# EasyEDA Pro project BH1750模块.epro

# Schematic BH1750模块
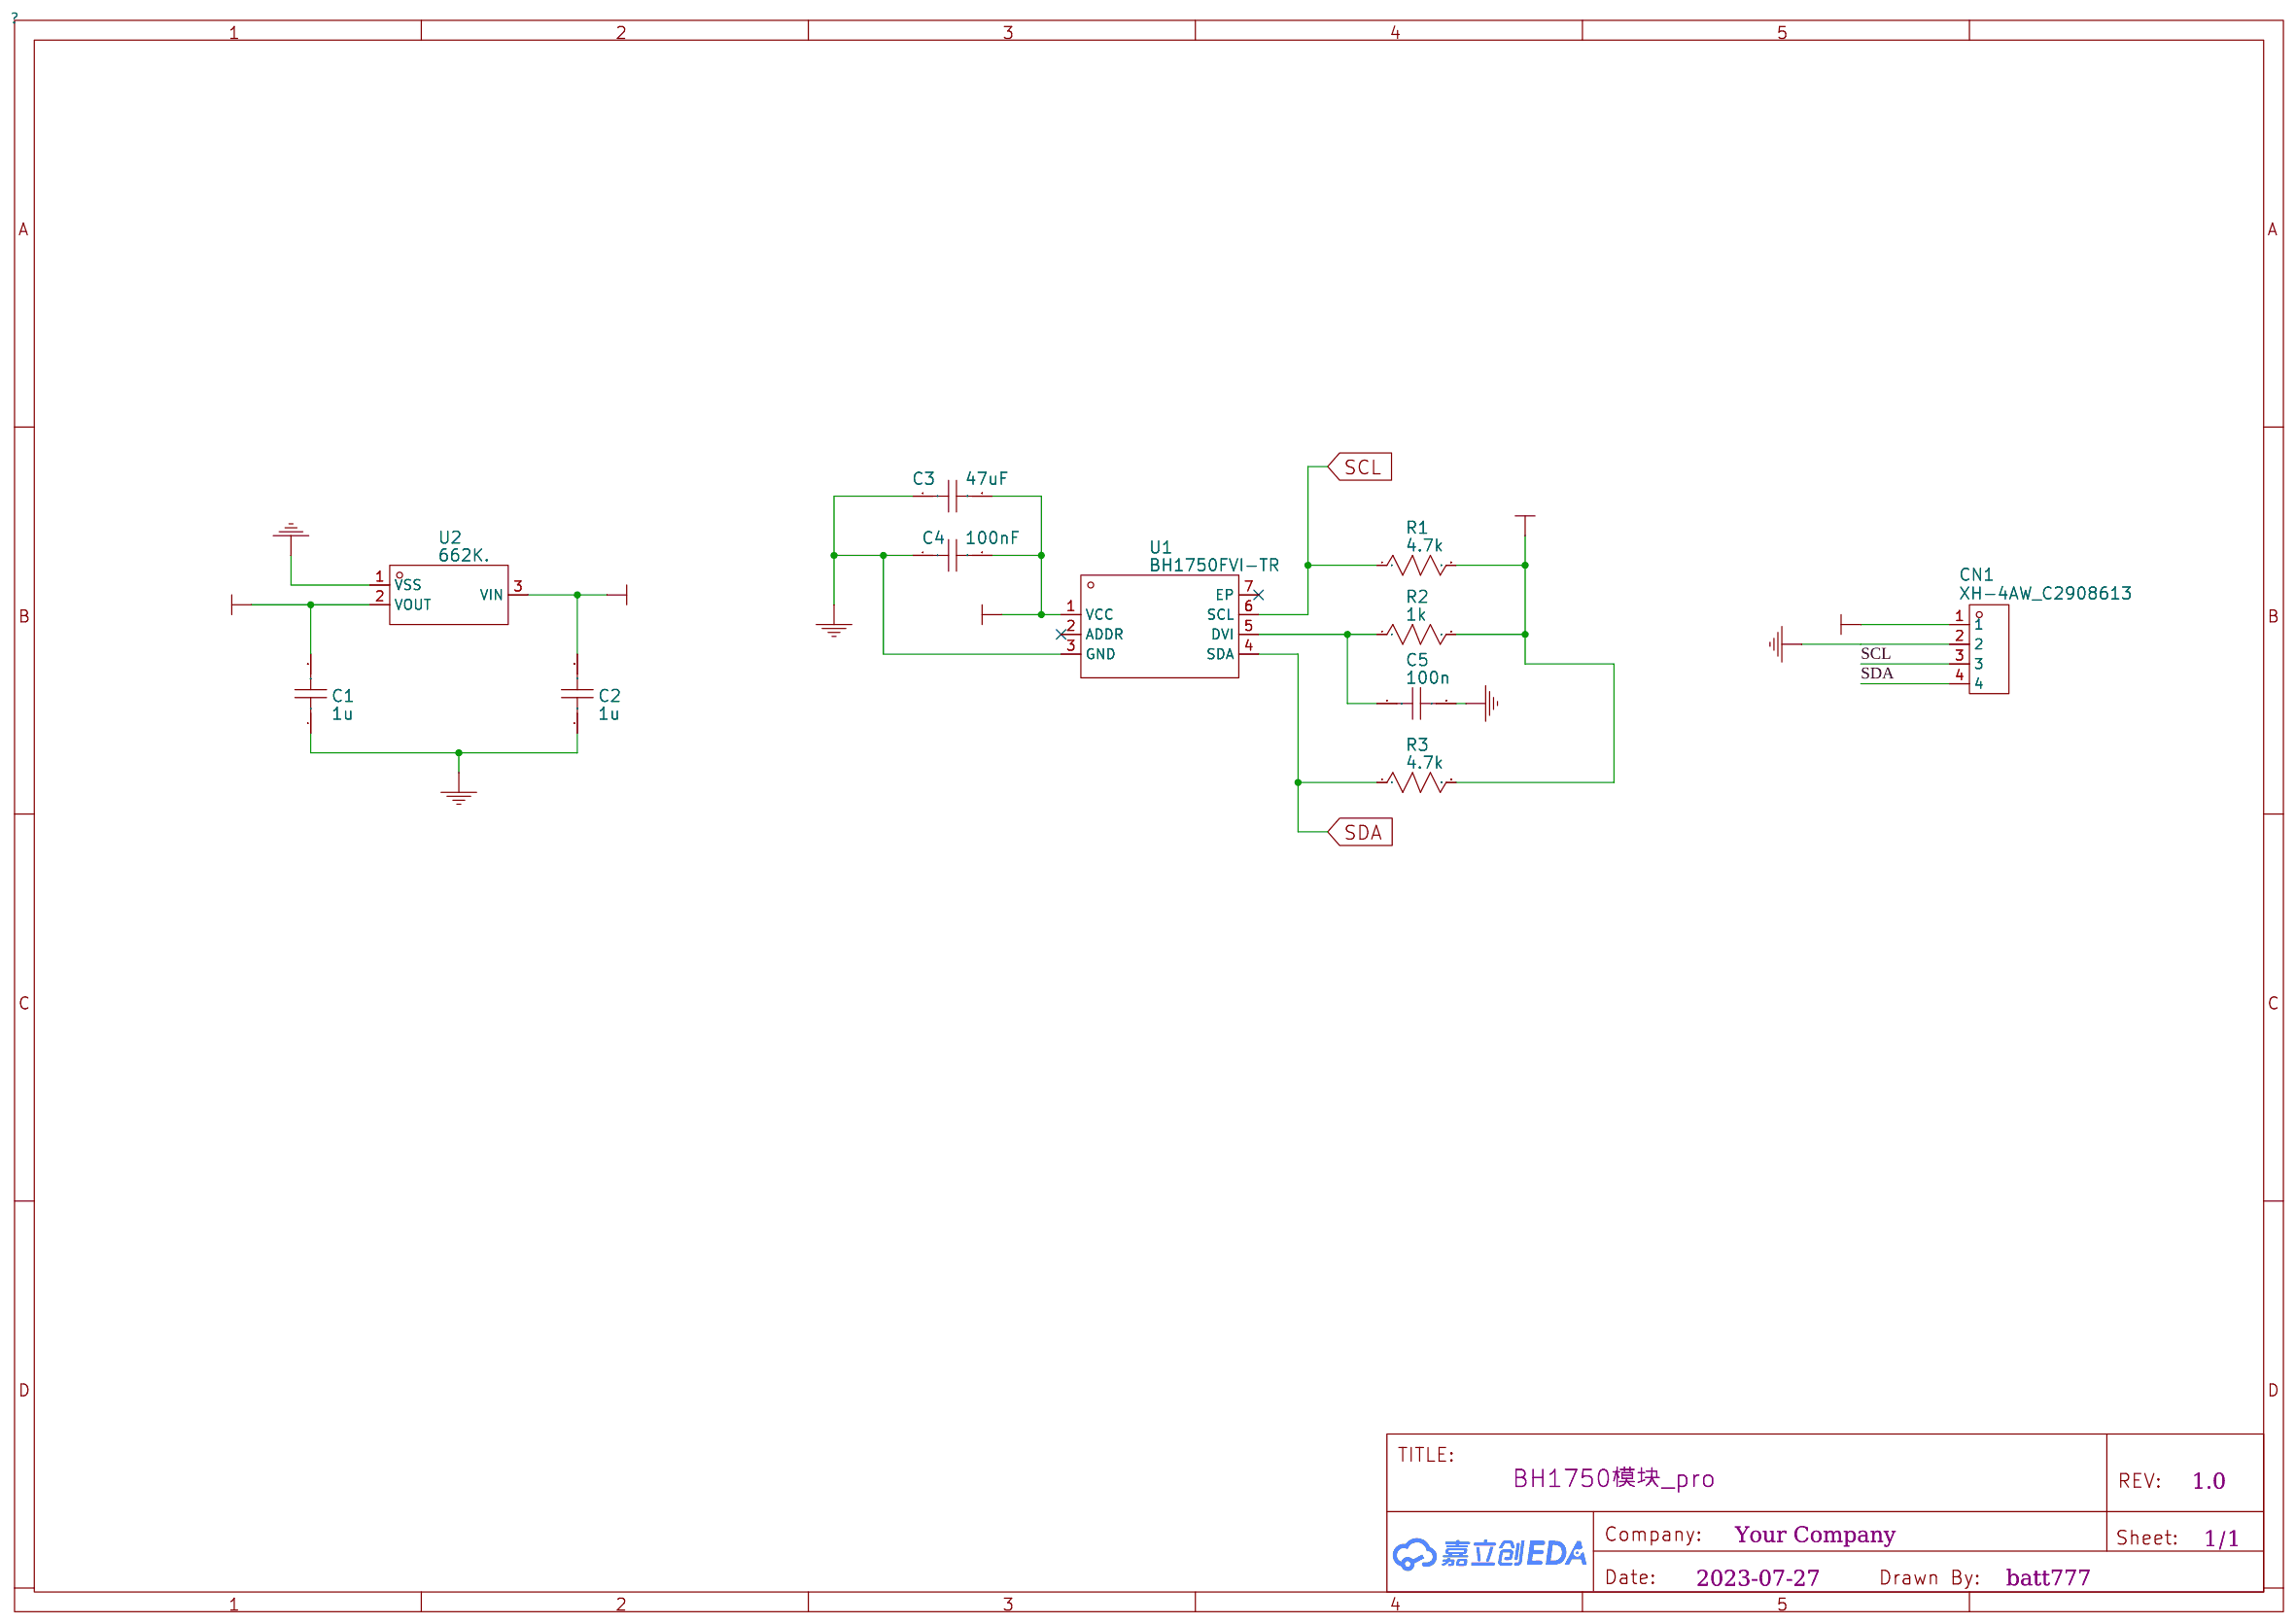
[diagram p0: schematic sheet]

## Parts
C1  1u  [C0603]
C2  1u  [C0603]
C3  47uF  [C0603]
C4  100nF  [C0603]
C5  100n  [C0603]
CN1  XH-4AW_C2908613  [CONN-TH_XH-4AW]
R1  4.7k  [R0603]
R2  1k  [R0603]
R3  4.7k  [R0603]
U1  BH1750FVI-TR  [WSOF-6_L2.6-W1.6-P0.50-TL-EP]
U2  662K.  [SOT-23-3_L2.9-W1.3-P1.90-LS2.4-BR]

## Library data of the parts
C1 C2 = 1u
C3 = 47uF
C4 = 100nF
C5 = 100n
CN1 = XH-4AW_C2908613: Supplier: LCSC; Supplier Part: C2908613; Manufacturer: HCTL(华灿天禄); Manufacturer Part: XH-4AW; JLCPCB Part Class: Extended Part
R1 R3 = 4.7k
R2 = 1k
U1 = BH1750FVI-TR: Supplier: LCSC; Manufacturer: ROHM(罗姆); Supplier Part: C78960; JLCPCB Part Class: Extended Part
U2 = 662K.: Supplier: LCSC; Supplier Part: C841298; Manufacturer: FM(富满); JLCPCB Part Class: Extended Part

## Nets
3V3: C1.2 C3.2 C4.2 R1.2 R2.2 R3.2 U1.1(VCC) U2.2(VOUT)
+5V: C2.2 CN1.1 U2.3(VIN)
GND: C1.1 C2.1 C3.1 C4.1 C5.2 CN1.2 U1.3(GND) U2.1(VSS)
SCL: CN1.3 R1.1 U1.6(SCL)
SDA: CN1.4 R3.1 U1.4(SDA)
$1N171: C5.1 R2.1 U1.5(DVI)

Not connected (* = marked no-connect by the designer): U1 2(ADDR)* 7(EP)*

# Board PCB_BH1750模块
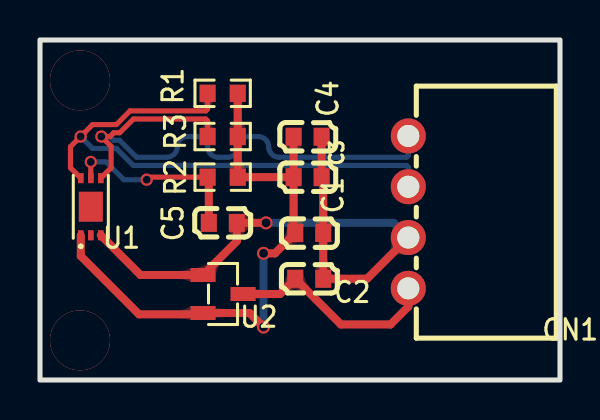
[diagram p1: board, top side]
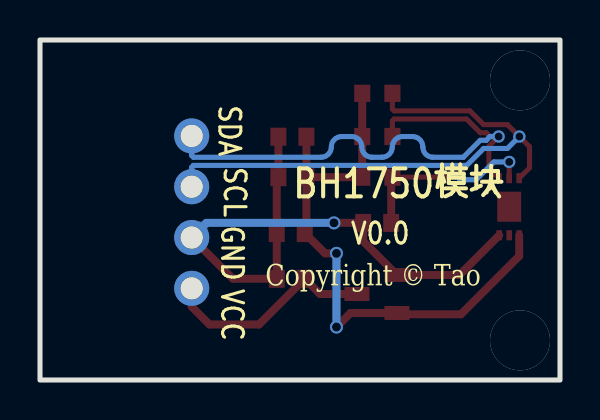
[diagram p2: board, bottom side, seen from below]

Outline 26 x 17 mm; copper layers: Top Layer, Inner1, Inner2, Inner3, Inner4, Inner5, Inner6, Inner7, Inner8, Inner9, Inner10, Inner11, Inner12, Inner13, Inner14, Inner15, Inner16, Inner17, Inner18, Inner19, Inner20, Inner21, Inner22, Inner23, Inner24, Inner25, Inner26, Inner27, Inner28, Inner29, Inner30, Bottom Layer. Coordinates in mm from the lower left corner of the outline.
Outline path: rectangle 0,17 26,0
Stack: Top Layer 0.035mm / Dielectric1 1.51mm FR4 er 4.5 / Bottom Layer 0.035mm

## Design rules (mm)
net SCL: IIC
net SDA: IIC
template: 用户自定义配置
spacing Default (default): track to track 0.152, other pairs 0 to 0.152
track width Default (default): min 0.254, default 0.254, max 25.4
track width POWER: min 0.4, default 0.45, max 0.5
differential pair differentialPair (default): width min 0.127, default 0.254, max 2.54; gap min 0.152, default 0.152
via Default (default): diameter min 0.61, default 0.61, max 100.025; hole min 0.305, default 0.305, max 59.995
net 3V3 uses POWER
net GND uses POWER
net +5V uses POWER

## Placement (name value [footprint] x y rotation side)
C1  1u  [C0603]  13.46 7.35 180 top
C2  1u  [C0603]  13.46 5.06 180 top
C3  47uF  [C0603]  13.38 10.14 180 top
C4  100nF  [C0603]  13.38 12.16 180 top
C5  100n  [C0603]  9.14 7.86 0 top
CN1  XH-4AW_C2908613  [CONN-TH_XH-4AW]  18.41 8.39 90 top
R1  4.7k  [R0603]  9.13 14.33 0 top
R2  1k  [R0603]  9.13 10.14 0 top
R3  4.7k  [R0603]  9.13 12.17 0 top
U1  BH1750FVI-TR  [WSOF-6_L2.6-W1.6-P0.50-TL-EP]  2.54 8.66 90 top
U2  662K.  [SOT-23-3_L2.9-W1.3-P1.90-LS2.4-BR]  9.15 4.3 180 top

## Footprints (pads in the part's own frame, mm; a bottom-side part is the same pattern mirrored in y, then rotated)
C0603
  rect 0.8x0.9 smd: 1(-0.7,0) 2(0.7,0)
CONN-TH_XH-4AW
  round 1.75 hole 1.1: 1(-3.81,0) 2(-1.27,0) 3(1.27,0) 4(3.81,0)
R0603
  rect 0.806x0.864 smd: 1(-0.753,0) 2(0.753,0)
SOT-23-3_L2.9-W1.3-P1.90-LS2.4-BR
  rect 1.25x0.7 smd: 1(1,-0.95) 2(1,0.95) 3(-1,0)
WSOF-6_L2.6-W1.6-P0.50-TL-EP
  rect 0.505x0.28 smd: 1(-1.427,0.5) 2(-1.427,0) 3(-1.427,-0.5) 4(1.427,-0.5) 5(1.427,0) 6(1.427,0.5)
  rect 1.5x1.2 smd: 7(0,0)

## Nets
As in the schematic.

Pads without a net: U1 2 7

## Via types
v1: diameter 3, hole 3, Top Layer to Bottom Layer, 2 vias
v2: diameter 0.65, hole 0.45, Top Layer to Bottom Layer, 3 vias
v3: diameter 0.61, hole 0.4, Top Layer to Bottom Layer, 4 vias

## Routing (per net, layer and track width the routed paths; a pad name or vN(x,y) marks a point on that pad's centre or on a via; arc(x,y) is an arc through that point)
3V3: length 29.2
  Top Layer w0.4: C3.2 12.68,7.43 C1.2 11.75,6.33 v2(11.18,6.33) ; C3.2 9.89,10.14 9.89,14.33 ; C3.2 C4.2 ; v2(11.18,2.65) 10.47,3.35 U2.2 8.08,3.28 4.95,3.28 2.04,6.2 U1.1
  Bottom Layer w0.4: v2(11.18,6.33) v2(11.18,2.65)
+5V: length 10.8
  Top Layer w0.4: U2.3 12,4.3 C2.2 15.05,2.78 17.53,2.78 18.41,3.67 CN1.1
GND: length 30.4
  Top Layer w0.4: CN1.2 16.35,5.06 C2.1 C1.1 14.16,10.06 C3.1 C4.1 ; U1.3 5.03,5.25 U2.1 9.84,6.94 C5.2 v2(11.3,7.86)
  Bottom Layer w0.4: v2(11.3,7.86) 17.68,7.86 CN1.2
(no net):
  vias: v1(2,14.98) v1(2,1.98)
SCL: length 28.2
  Top Layer w0.254: U1.6 1.52,10.61 1.52,11.67 v3(2.03,12.17) 2.63,12.77 3.82,12.77 4.5,13.46 8.29,13.46 8.38,13.55 R1.1
  Bottom Layer w0.254: CN1.3 18.41,10.64 18.32,10.73 4.66,10.73 3.82,11.58 2.63,11.58 v3(2.03,12.17)
SDA: length 28.2
  Top Layer w0.254: U1.4 3.56,10.61 3.56,11.69 v3(3.07,12.17) 3.5,12.17 3.69,12.36 3.99,12.36 4.67,13.05 8.29,13.05 8.38,12.96 R3.1
  Bottom Layer w0.254: v3(3.07,12.17) 3.5,12.17 3.69,11.98 3.99,11.98 4.83,11.14 6.34,11.14 arc(6.71,11.29) 6.86,11.66 arc(7.01,12.02) 7.38,12.17 7.87,12.17 arc(8.23,12.02) 8.38,11.66 arc(8.54,11.29) 8.9,11.14 9.39,11.14 arc(9.76,11.29) 9.91,11.66 arc(10.06,12.02) 10.43,12.17 10.91,12.17 arc(11.28,12.02) 11.43,11.66 arc(11.58,11.29) 11.95,11.14 18.32,11.14 18.41,11.23 CN1.4
$1N171: length 9.5
  Top Layer w0.254: v3(2.54,10.9) 2.54,10.01 ; R2.1 5.46,10.14 v3(5.33,10.02)
  Top Layer w0.4: R2.1 8.44,10.08 C5.1
  Bottom Layer w0.254: v3(5.33,10.02) 4.19,10.02 3.3,10.9 v3(2.54,10.9)

Small or netless copper shapes (teardrops, artwork), in the pictures only: 35 on Top Layer, 8 on Bottom Layer

## Text on the board
Bottom Silkscreen Layer: V0.0 | SCL | GND | VCC | SDA | Copyright © Tao | BH1750模块
